# Altium schematic sheet dv_power.SchDoc: =GlobalProjectName
size 410 x 297 mm; SheetNumber: 1; SheetTotal: 2; PageSetup: Record=PageOptions|CenterHorizontal=True|CenterVertical=True|PrintScale=1.00|XCorrection=1.00|YCorrection=1.00|PrintKind=1|BorderSize=5000000|LeftOffset=0|BottomOffset=0|Orientation=2|PaperLength=1000|PaperWidth=1000|Scale=100|PaperSource=15|PrintQuality=1200|MediaType=1|DitherType=10|PaperKind=A3|PrintScaleMode=1; Weight: -; ScaleFactor: -
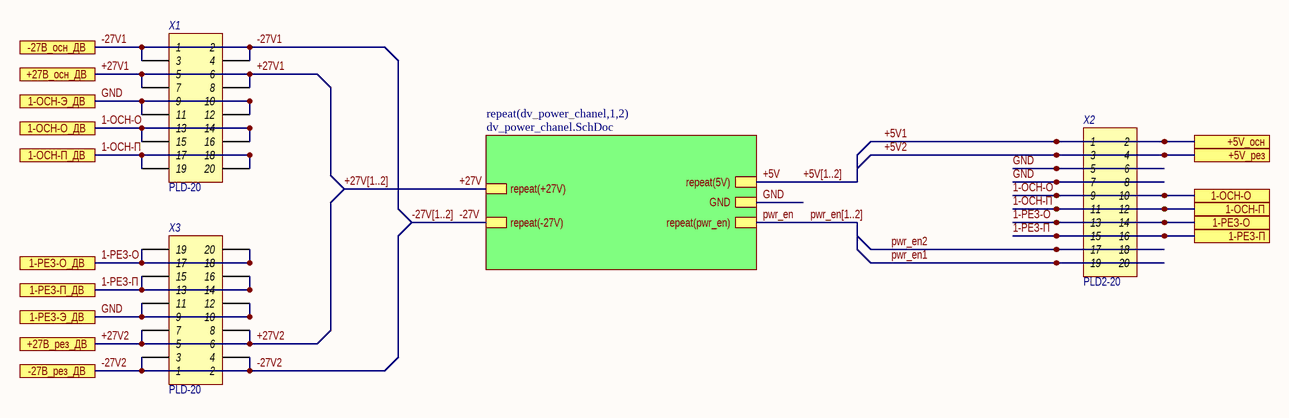
[diagram p0: dv_power.SchDoc]

## Parts
X1  Наименование: PLD-20  [PBD-20]  (hidden comment: Header 2X20)
X2  Наименование: PLD2-20  [SD87340-20]  (hidden comment: Header 2X20)
X3  Наименование: PLD-20  [PBD-20]  (hidden comment: Header 2X20)

## Sub-sheets
repeat(dv_power_chanel,1,2) = dv_power_chanel.SchDoc: repeat(-27V), GND, repeat(5V), repeat(pwr_en), repeat(+27V)

## Ports
1-ОСН-О, 1-ОСН-О_ДВ, 1-ОСН-П, 1-ОСН-П_ДВ, 1-ОСН-Э_ДВ, 1-РЕЗ-О, 1-РЕЗ-О_ДВ, 1-РЕЗ-П, 1-РЕЗ-П_ДВ, 1-РЕЗ-Э_ДВ, +5V_осн, +5V_рез, +27В_осн_ДВ, +27В_рез_ДВ, -27В_осн_ДВ, -27В_рез_ДВ

## Nets
1-ОСН-О: X1.13 X1.14 X1.15 X1.16 X2.9 X2.10 ; port 1-ОСН-О, port 1-ОСН-О_ДВ
1-ОСН-П: X1.17 X1.18 X1.19 X1.20 X2.11 X2.12 ; port 1-ОСН-П, port 1-ОСН-П_ДВ
1-РЕЗ-О: X2.13 X2.14 X3.17 X3.18 X3.19 X3.20 ; port 1-РЕЗ-О, port 1-РЕЗ-О_ДВ
1-РЕЗ-П: X2.15 X2.16 X3.13 X3.14 X3.15 X3.16 ; port 1-РЕЗ-П, port 1-РЕЗ-П_ДВ
+5V: sheet repeat(dv_power_chanel,1,2)/repeat(5V)  [also labelled +5V[1..2]]
+5V1: X2.1 X2.2 ; port +5V_осн
+5V2: X2.3 X2.4 ; port +5V_рез
+27V: sheet repeat(dv_power_chanel,1,2)/repeat(+27V)
+27V1: X1.5 X1.6 X1.7 X1.8 ; port +27В_осн_ДВ
+27V2: X3.5 X3.6 X3.7 X3.8 ; port +27В_рез_ДВ
-27V: sheet repeat(dv_power_chanel,1,2)/repeat(-27V)
-27V1: X1.1 X1.2 X1.3 X1.4 ; port -27В_осн_ДВ
-27V2: X3.1 X3.2 X3.3 X3.4 ; port -27В_рез_ДВ
GND: X1.9 X1.10 X1.11 X1.12 X2.5 X2.6 X2.7 X2.8 X3.9 X3.10 X3.11 X3.12 ; port 1-ОСН-Э_ДВ, port 1-РЕЗ-Э_ДВ, sheet repeat(dv_power_chanel,1,2)/GND
pwr_en: sheet repeat(dv_power_chanel,1,2)/repeat(pwr_en)
pwr_en1: X2.19 X2.20
pwr_en2: X2.17 X2.18

## Buses and harness runs
bus +27V[1..2]
bus -27V[1..2]
bus pwr_en[1..2]

## Notes on the sheet
- Перв. примен.
- Справ. №
- Подп. и дата
- Инв. № дубл.
- Взам. инв. №
- Изм.
- Разраб.
- Лист
- № докум.
- Подп.
- Дата
- Литера
- Масса
- Масштаб
- Пров.
- Т.контр.
- Листов
- Н.контр.
- Утв.
- Инв. № подл.
- Форма 1 ГОСТ 2.104-2006
- Копировал
- Формат А3

## Library data of the parts
X1-X3 = Header 2X20: Header, 20-Pin, Dual row; Потребление, Вт: 0,0; Назначение: Header, 20-Pin, Dual row